# EAGLE design NSE2020_1 (EAGLE 9.6.1)
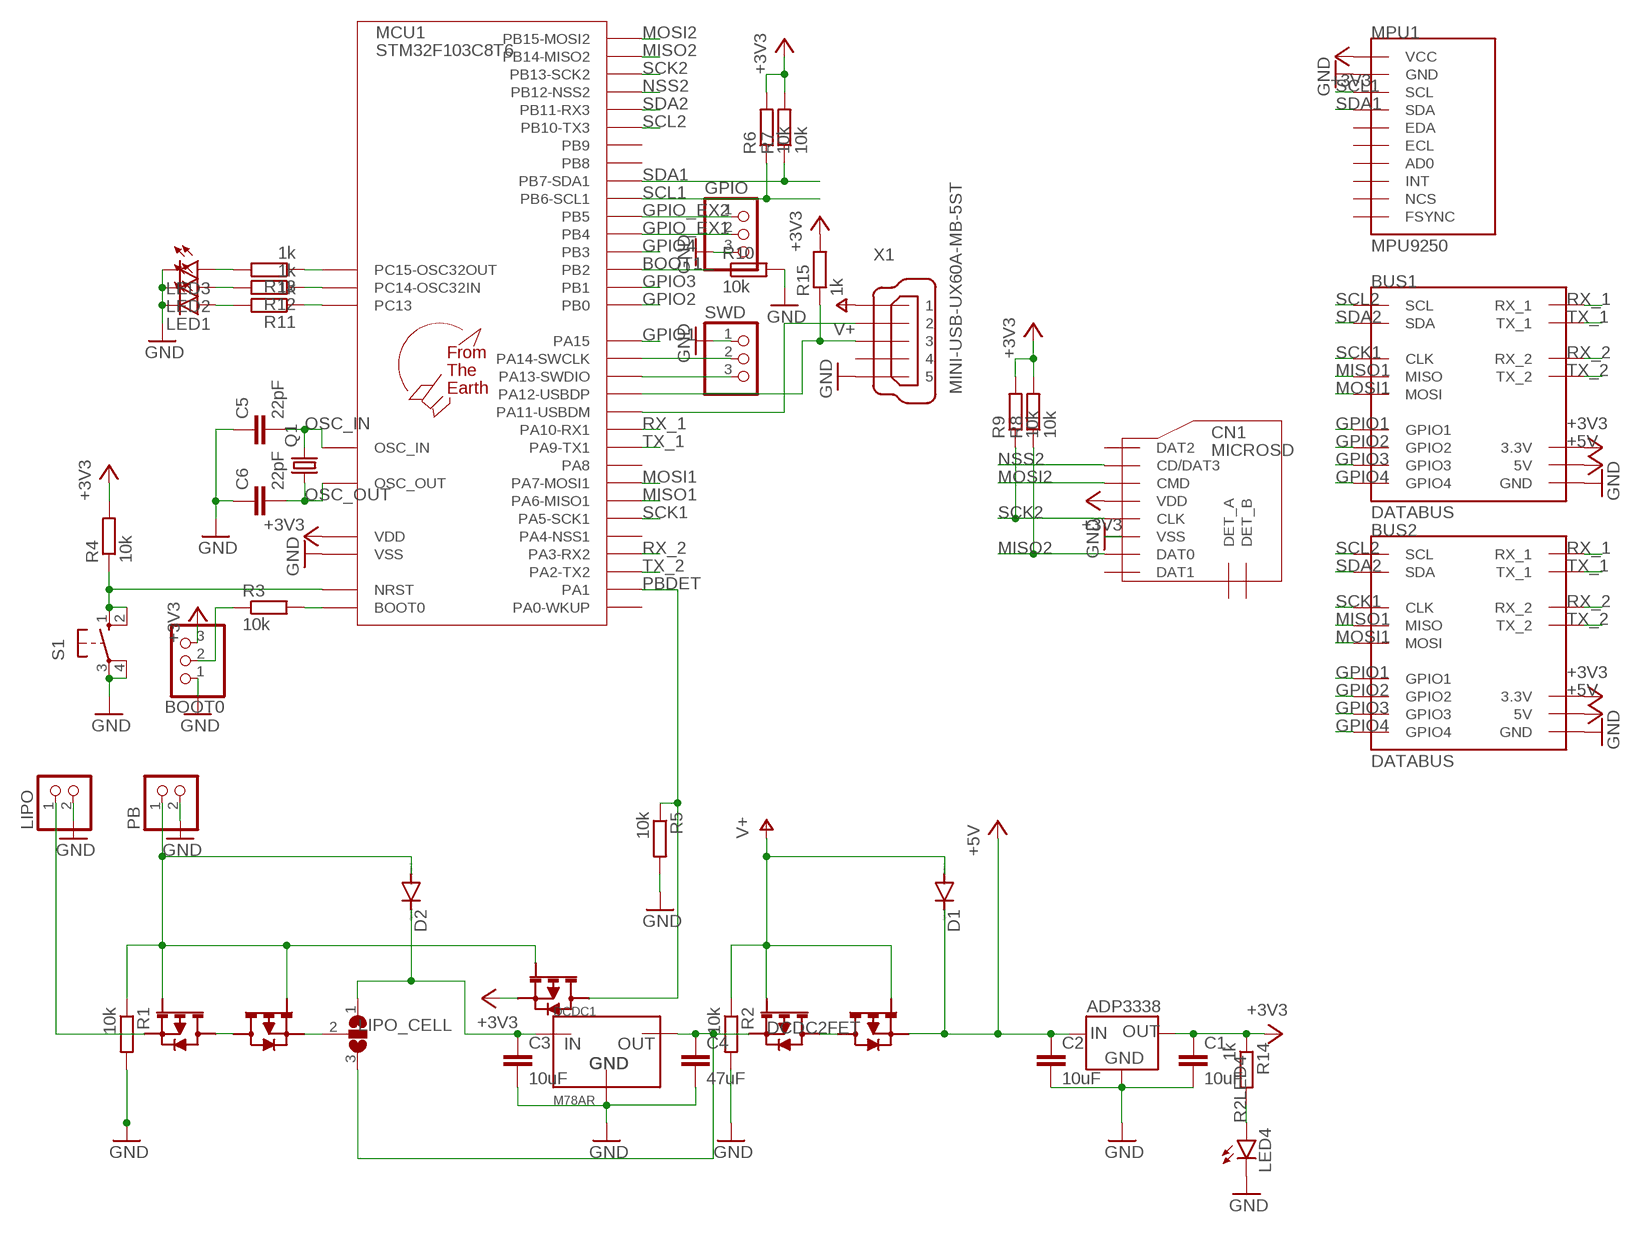
[diagram p0: schematic, sheet 1]

## Parts
BOOT0  PINHD-1X3  [1X03]
BUS1  DATABUS  [8X2]
BUS2  DATABUS  [8X2]
C1  10uF  C-EUC2012  [C2012]
C2  10uF  C-EUC2012  [C2012]
C3  10uF  C-EUC2012  [C2012]
C4  47uF  C-EUC2012  [C2012]
C5  22pF  C-EUC2012  [C2012]
C6  22pF  C-EUC2012  [C2012]
CN1  MICROSD  [DM3AT]
D1  DIODE-SOD123  [SOD123]
D2  DIODE-SOD123  [SOD123]
DCDC1  M78AR  [M78AR]
FET1  2SJ681  [2SJ681]
FET2  2SJ681  [2SJ681]
FET3  2SJ681  [2SJ681]
FET4  2SJ681  [2SJ681]
FET5  2SJ681  [2SJ681]
GPIO  PINHD-1X3  [1X03]
IC1  ADP3338-3.3  [SOT-223]
LED1  LEDSML0805  [SML0805]
LED2  LEDSML0805  [SML0805]
LED3  LEDSML0805  [SML0805]
LED4  LEDSML0805  [SML0805]
LIPO  PINHD-1X2  [1X02]
LIPO_CELL  SJ2W  [SJ_2]
MCU1  STM32F103C8T6  [LQFP48]
MPU1  MPU9250  [GY-9250]
PB  PINHD-1X2  [1X02]
Q1  CRYSTALHC49S  [HC49/S]
R1  10k  R-EU_M2012  [M2012]
R2  10k  R-EU_M2012  [M2012]
R3  10k  R-EU_M2012  [M2012]
R4  10k  R-EU_M2012  [M2012]
R5  10k  R-EU_M2012  [M2012]
R6  10k  R-EU_M2012  [M2012]
R7  10k  R-EU_M2012  [M2012]
R8  10k  R-EU_M2012  [M2012]
R9  10k  R-EU_M2012  [M2012]
R10  10k  R-EU_M2012  [M2012]
R11  1k  R-EU_M2012  [M2012]
R12  1k  R-EU_M2012  [M2012]
R13  1k  R-EU_M2012  [M2012]
R14  1k  R-EU_M2012  [M2012]
R15  1k  R-EU_M2012  [M2012]
S1  10-XX  [B3F-10XX]
SWD  PINHD-1X3  [1X03]
U$1  F.T.E.LOGO  [LOGO]
X1  MINI-USB-UX60A-MB-5ST  [UX60A-MB-5ST]

## Nets
+3V3 [PWR_L]: BOOT0.3 BUS1.P6(3.3V) BUS2.P6(3.3V) C1.1 CN1.VDD FET5.P$3 IC1.1(OUT) IC1.2(OUT) MCU1.1(VDD) MCU1.9(VDD) MCU1.24(VDD) MCU1.36(VDD) MCU1.48(VDD) MPU1.P1(VCC) R4.2 R6.2 R7.2 R8.2 R9.2 R14.1 R15.2
+5V [PWR_H]: BUS1.P7(5V) BUS2.P7(5V) C2.1 D1.C FET4.P$3 IC1.3(IN)
BAT2DCDC [PWR_H]: C3.1 D2.C DCDC1.P1(IN) LIPO_CELL.1
BOOT0 [SIGNAL]: BOOT0.2 R3.1
BOOT0_R [SIGNAL]: MCU1.44(BOOT0) R3.2
BOOT1 [SIGNAL]: MCU1.20(PB2) R10.1
DCDC2FET [PWR_H]: C4.1 DCDC1.P3(OUT) FET3.P$3 LIPO_CELL.3
DM [SIGNAL]: MCU1.32(PA11-USBDM) X1.2
DP [SIGNAL]: MCU1.33(PA12-USBDP) R15.1 X1.3
FET2FET [PWR_H]: FET3.P$2 FET3.P$4 FET4.P$2 FET4.P$4
FET2JUMP [PWR_H]: FET2.P$3 LIPO_CELL.2
GND [GND]: BOOT0.1 BUS1.P11(GND) BUS2.P11(GND) C1.2 C2.2 C3.2 C4.2 C5.1 C6.1 CN1.VSS DCDC1.P2(GND) GPIO.3 IC1.4(GND) LED1.C LED2.C LED3.C LED4.C LIPO.2 MCU1.8(VSS) MCU1.23(VSS) MCU1.35(VSS) MCU1.47(VSS) MPU1.P2(GND) PB.2 R1.2 R2.2 R5.2 R10.2 S1.3(P) S1.4(P1) SWD.1 X1.5
GPIO1 [SIGNAL]: BUS1.P3(GPIO1) BUS2.P3(GPIO1) MCU1.38(PA15)
GPIO2 [SIGNAL]: BUS1.P10(GPIO2) BUS2.P10(GPIO2) MCU1.18(PB0)
GPIO3 [SIGNAL]: BUS1.P14(GPIO3) BUS2.P14(GPIO3) MCU1.19(PB1)
GPIO4 [SIGNAL]: BUS1.P15(GPIO4) BUS2.P15(GPIO4) MCU1.39(PB3)
GPIO_EX1 [IO]: GPIO.2 MCU1.40(PB4)
GPIO_EX2 [IO]: GPIO.1 MCU1.41(PB5)
IO2R1 [IO]: MCU1.2(PC13) R11.1
IO2R2 [IO]: MCU1.3(PC14-OSC32IN) R12.1
IO2R3 [IO]: MCU1.4(PC15-OSC32OUT) R13.1
LIPO_FET2FET [PWR_H]: FET1.P$2 FET1.P$4 FET2.P$2 FET2.P$4
LIPOIN [PWR_H]: FET1.P$3 LIPO.1
MISO1 [SIGNAL]: BUS1.P12(MISO) BUS2.P12(MISO) MCU1.16(PA6-MISO1)
MISO2 [SIGNAL]: CN1.DAT0 MCU1.27(PB14-MISO2) R8.1
MOSI1 [SIGNAL]: BUS1.P2(MOSI) BUS2.P2(MOSI) MCU1.17(PA7-MOSI1)
MOSI2 [SIGNAL]: CN1.CMD MCU1.28(PB15-MOSI2)
NRST [SIGNAL]: MCU1.7(NRST) R4.1 S1.1(S) S1.2(S1)
NSS2 [SIGNAL]: CN1.CD/DAT3 MCU1.25(PB12-NSS2)
OSC_IN [IO]: C5.2 MCU1.5(OSC_IN) Q1.2
OSC_OUT [IO]: C6.2 MCU1.6(OSC_OUT) Q1.1
PBDET [SIGNAL]: FET5.P$2 FET5.P$4 MCU1.11(PA1) R5.1
PBIN [PWR_H]: D2.A FET1.P$1 FET2.P$1 FET5.P$1 PB.1 R1.1
R2LED1 [IO]: LED1.A R11.2
R2LED2 [IO]: LED2.A R12.2
R2LED3 [IO]: LED3.A R13.2
R2LED4 [IO]: LED4.A R14.2
RX_1 [SIGNAL]: BUS1.P4(RX_1) BUS2.P4(RX_1) MCU1.31(PA10-RX1)
RX_2 [SIGNAL]: BUS1.P9(RX_2) BUS2.P9(RX_2) MCU1.13(PA3-RX2)
SCK1 [SIGNAL]: BUS1.P1(CLK) BUS2.P1(CLK) MCU1.15(PA5-SCK1)
SCK2 [SIGNAL]: CN1.CLK MCU1.26(PB13-SCK2) R9.1
SCL1 [SIGNAL]: MCU1.42(PB6-SCL1) MPU1.P3(SCL) R6.1
SCL2 [SIGNAL]: BUS1.P0(SCL) BUS2.P0(SCL) MCU1.21(PB10-TX3)
SDA1 [SIGNAL]: MCU1.43(PB7-SDA1) MPU1.P4(SDA) R7.1
SDA2 [SIGNAL]: BUS1.P13(SDA) BUS2.P13(SDA) MCU1.22(PB11-RX3)
SWCLK [SIGNAL]: MCU1.37(PA14-SWCLK) SWD.2
SWDIO [SIGNAL]: MCU1.34(PA13-SWDIO) SWD.3
TX_1 [SIGNAL]: BUS1.P5(TX_1) BUS2.P5(TX_1) MCU1.30(PA9-TX1)
TX_2 [SIGNAL]: BUS1.P8(TX_2) BUS2.P8(TX_2) MCU1.12(PA2-TX2)
V+ [PWR_H]: D1.A FET3.P$1 FET4.P$1 R2.1 X1.1
Unconnected: CN1.DAT1 CN1.DAT2 CN1.DET_A CN1.DET_B MCU1.10(PA0-WKUP) MCU1.14(PA4-NSS1) MCU1.29(PA8) MCU1.45(PB8) MCU1.46(PB9) MPU1.P5(EDA) MPU1.P6(ECL) MPU1.P7(AD0) MPU1.P8(INT) MPU1.P9(NCS) MPU1.P10(FSYNC) X1.4

## Library data of the parts
BOOT0 GPIO SWD = pinhead:PINHD-1X3: PIN HEADER
BUS1 BUS2 = databus:DATABUS
C1-C6 = rcl:C-EU: CAPACITOR, European symbol; SPICEPREFIX: C
CN1 = microSD:MICROSD
D1 D2 = diode:DIODE-: DIODE
DCDC1 = M78AR:M78AR
FET1-FET5 = 2SJ681:2SJ681
IC1 = ADP3338:ADP3338-3.3
LED1-LED4 = led:LED: LED OSRAM: - CHIPLED LG R971, LG N971, LY N971, LG Q971, LY Q971, LO R971, LY R971 LH N974, LH R974 LS Q976, LO Q976, LY Q976 LO Q996 - Hyper CHIPLED LW Q18S LB Q993, LB Q99A, LB R99A - SideLED LS A670, LO A670, LY A670, LG A670, LP A670 LB A673, LV A673, LT A673, LW A673 LH A674 LY A675 LS A676, LA A676, LO A676, LY A676, LW A676 LS A679, LY A679, LG A679 - Hyper Micro SIDELED® LS Y876, LA Y876, LO Y876, LY Y876 LT Y87S - SmartLED LW L88C, LW L88S LB L89C, LB L89S, LG L890 LS L89K, LO L89K, LY L89K LS L896, LA L896, LO L896, LY L896 - TOPLED LS T670, LO T670, LY T670, LG T670, LP T670 LSG T670, LSP T670, LSY T670, LOP T670, LYG T670 LG T671, LOG T671, LSG T671 LB T673, LV T673, LT T673, LW T673 LH T674 LS T676, LA T676, LO T676, LY T676, LB T676, LH T676, LSB T676, LW T676 LB T67C, LV T67C, LT T67C, LS T67K, LO T67K, LY T67K, LW E67C LS E67B, LA E67B, LO E67B, LY E67B, LB E67C, LV E67C, LT E67C LW T67C LS T679, LY T679, LG T679 LS T770, LO T770, LY T770, LG T770, LP T770 LB T773, LV T773, LT T773, LW T773 LH T774 LS E675, LA E675, LY E675, LS T675 LS T776, LA T776, LO T776, LY T776, LB T776 LHGB T686 LT T68C, LB T68C - Hyper Mini TOPLED® LB M676 - Mini TOPLED Santana® LG M470 LS M47K, LO M47K, LY M47K Source: http://www.osram.convergy.de LUXEON: - LUMILED® LXK2-PW12-R00, LXK2-PW12-S00, LXK2-PW14-U00, LXK2-PW14-V00 LXK2-PM12-R00, LXK2-PM12-S00, LXK2-PM14-U00 LXK2-PE12-Q00, LXK2-PE12-R00, LXK2-PE12-S00, LXK2-PE14-T00, LXK2-PE14-U00 LXK2-PB12-K00, LXK2-PB12-L00, LXK2-PB12-M00, LXK2-PB14-N00, LXK2-PB14-P00, LXK2-PB14-Q00 LXK2-PR12-L00, LXK2-PR12-M00, LXK2-PR14-Q00, LXK2-PR14-R00 LXK2-PD12-Q00, LXK2-PD12-R00, LXK2-PD12-S00 LXK2-PH12-R00, LXK2-PH12-S00 LXK2-PL12-P00, LXK2-PL12-Q00, LXK2-PL12-R00 Source: www.luxeon.com KINGBRIGHT: KA-3528ASYC Source: www.kingbright.com
LIPO PB = pinhead:PINHD-1X2: PIN HEADER
LIPO_CELL = jumper:SJ2W: SMD solder JUMPER
MCU1 = STM32F103C8T6:STM32F103C8T6
MPU1 = MPU9250:MPU9250
Q1 = crystal:CRYSTAL: CRYSTAL; OC_FARNELL: 1667008; OC_NEWARK: unknown
R1-R15 = rcl:R-EU_: RESISTOR, European symbol; SPICEPREFIX: R
S1 = switch-omron:10-XX: OMRON SWITCH; MPN: B3F-1000; OC_FARNELL: 176432; OC_NEWARK: 36M3542
U$1 = logo:F.T.E.LOGO
X1 = con-hirose:MINI-USB-: MINI USB Connector Source: http://www.hirose.co.jp/cataloge_hp/e24000019.pdf; OC_FARNELL: unknown; OC_NEWARK: unknown

## Net classes
1 SIGNAL: width 0.229 mm, drill 0.305 mm, clearance 0.152 mm
2 PWR_H: width 0.635 mm, drill 0.305 mm, clearance 0.152 mm
3 PWR_L: width 0.305 mm, drill 0.305 mm, clearance 0.152 mm
4 GND: width 0.381 mm, drill 0.305 mm, clearance 0.152 mm
5 IO: width 0.305 mm, drill 0.305 mm, clearance 0.152 mm

## Board
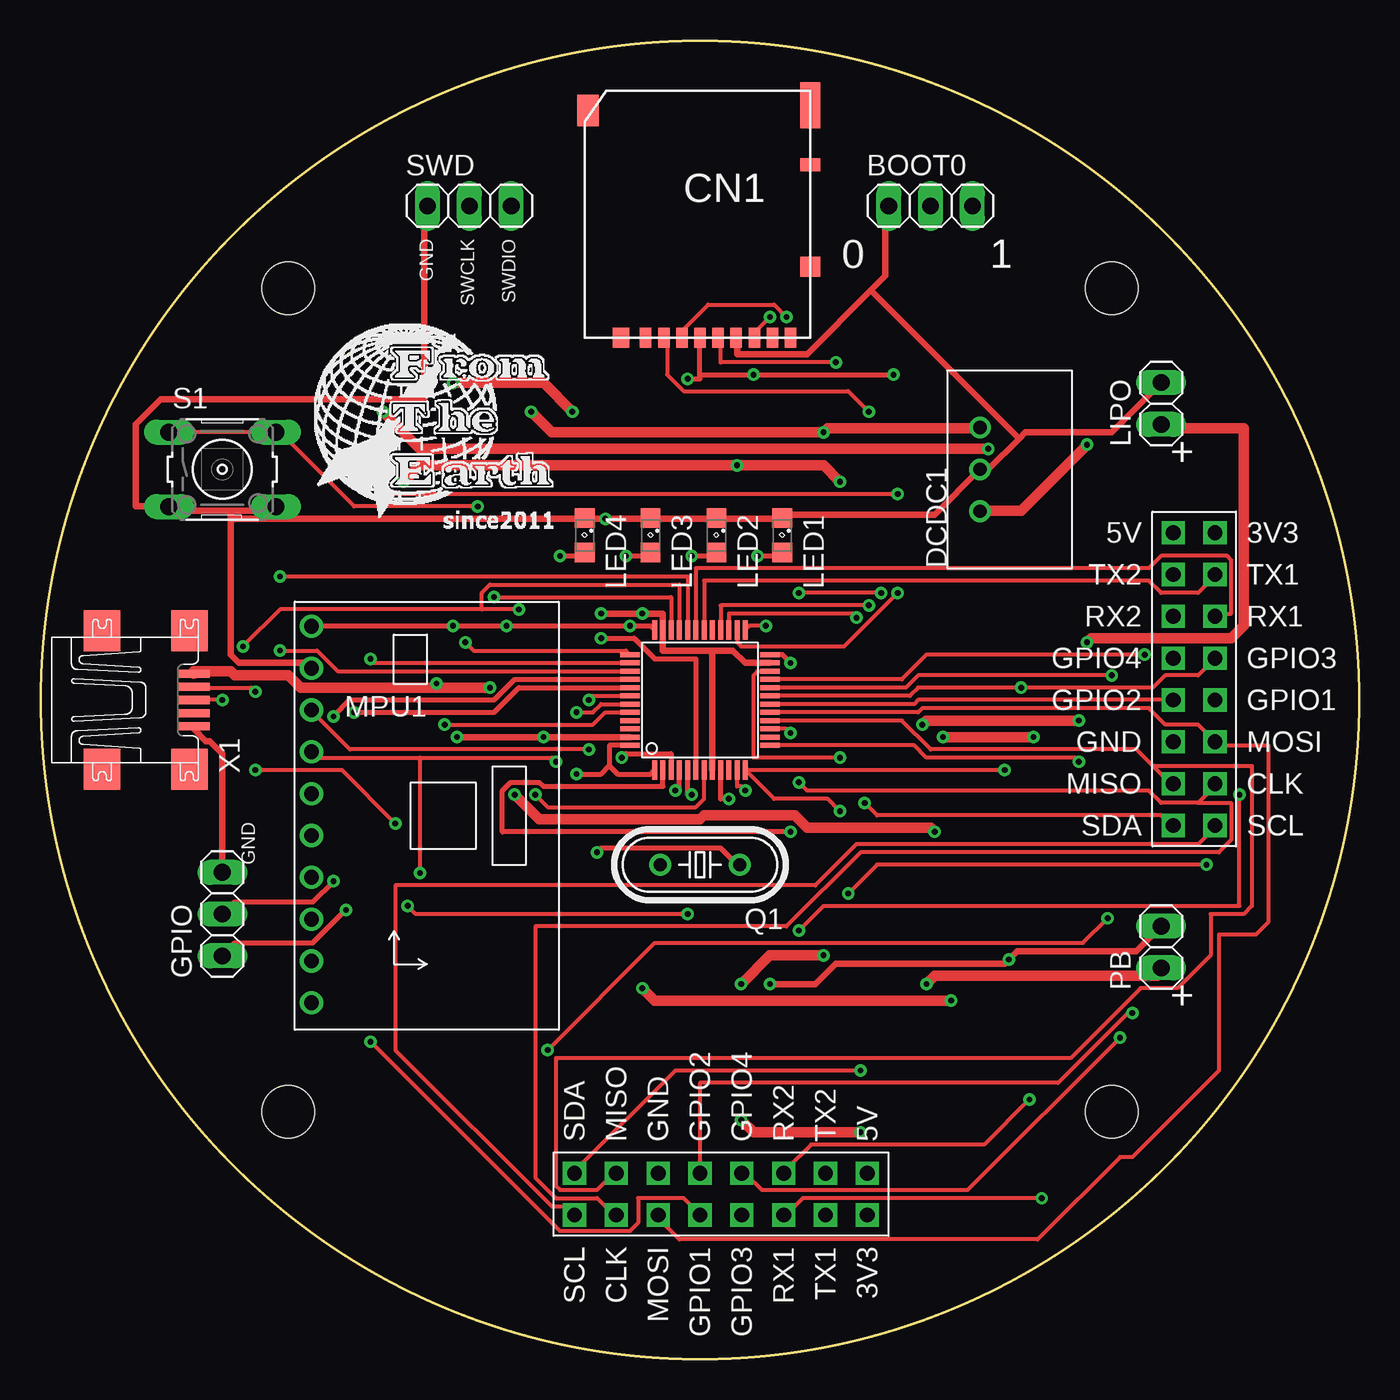
[diagram p1: board, top side]
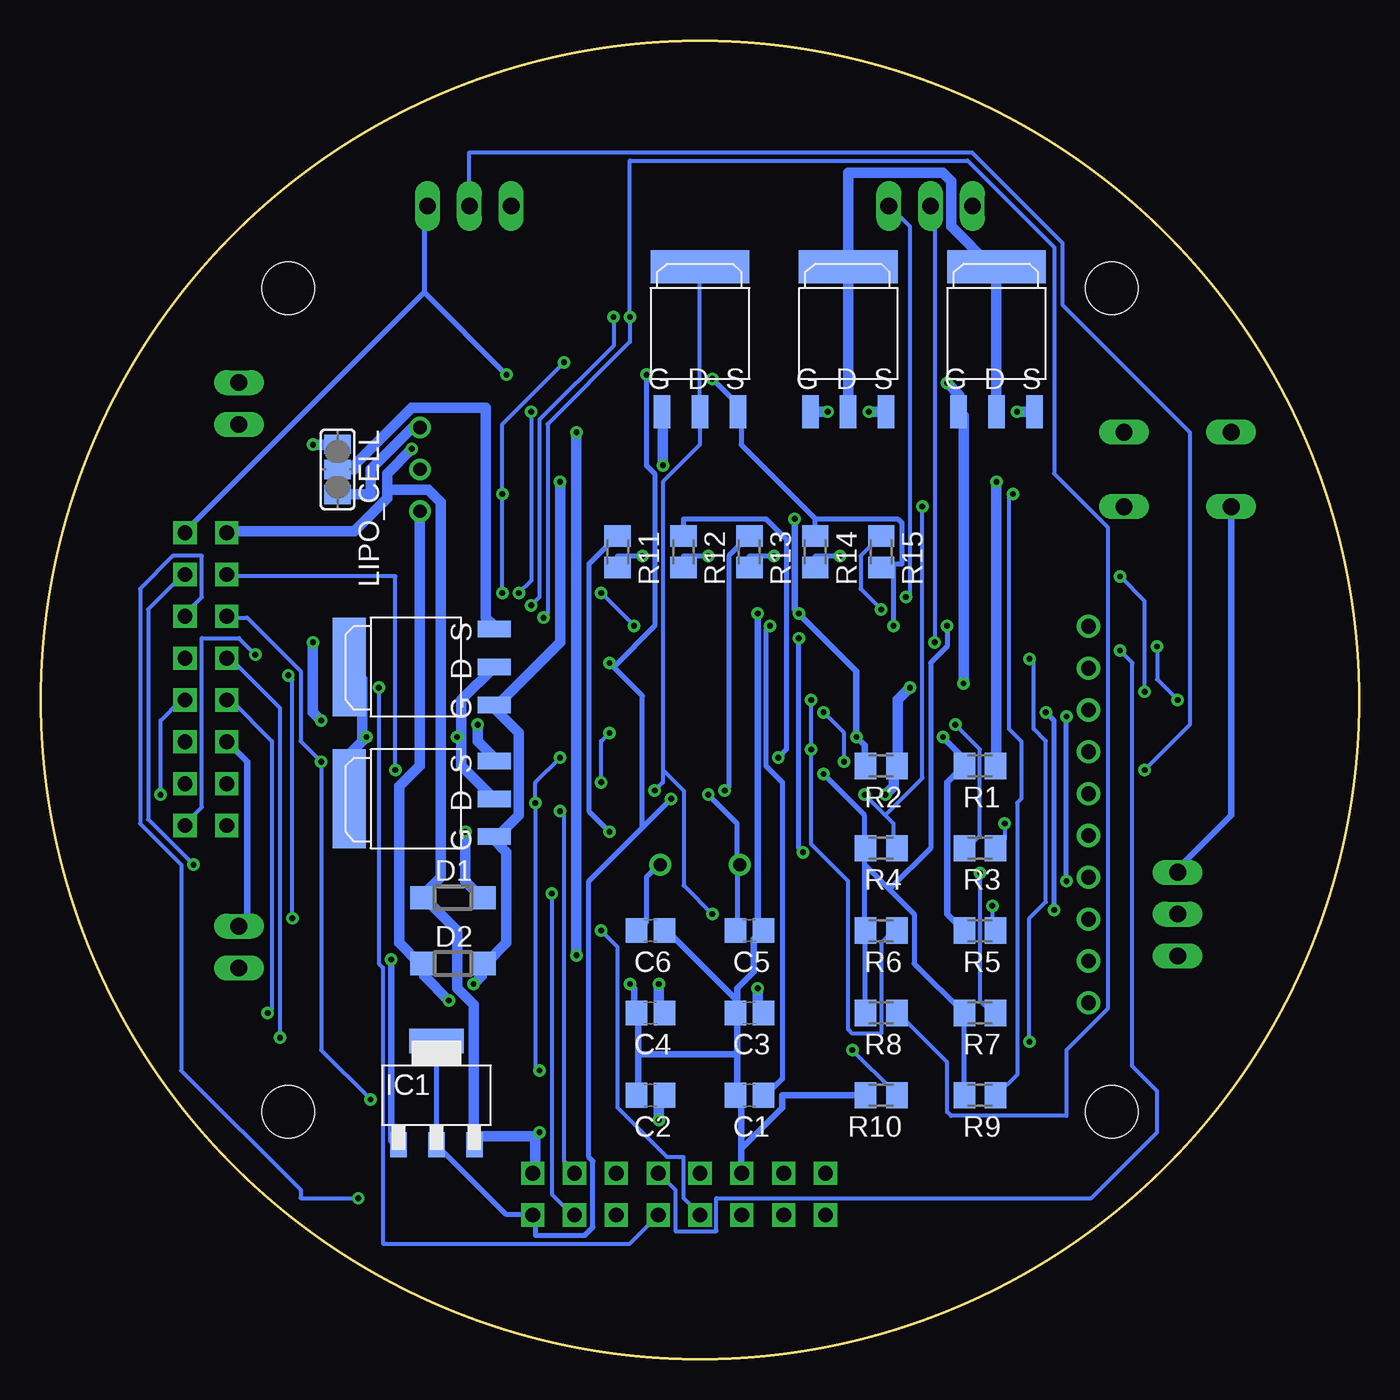
[diagram p2: board, bottom side, seen from below]

Size 80 x 80 mm. Coordinates in mm from the lower left corner, seen from the top.
Outline: circle at 40,40 radius 40
Copper layers (1*16): Top 0.035mm / dielectric 1.5mm / Bottom 0.035mm
Design rules "default": minimum track width 6mil, minimum drill 0.35mm, track to track 6mil, track to pad 6mil, pad to pad 6mil, via to via 6mil, smd to smd 6mil, copper to edge 40mil, drill to drill 6mil, minimum pad ring 10mil, minimum via ring 8mil, stop-mask expansion 4mil, vias tented up to drill 0mil, thermal gap 10mil
Holes 3.2 mm at 15,15 65,15 65,65 15,65
vRestrict: area 36,36 to 44,44

### Footprints (pad centres in the part's own frame; a part is rotated, then mirrored left to right if it is on the bottom)
1X03 = drill 1.016 long: 1 -2.54,0; 2 0,0; 3 2.54,0
8X2 = drill 0.9 square: P0 -1.27,7.62; P1 -1.27,5.08; P2 -1.27,2.54; P3 -1.27,0; P4 -1.27,-5.08; P5 -1.27,-7.62; P6 -1.27,-10.16; P7 1.27,-10.16; P8 1.27,-7.62; P9 1.27,-5.08; P10 1.27,0; P11 1.27,2.54; P12 1.27,5.08; P13 1.27,7.62; P14 -1.27,-2.54; P15 1.27,-2.54
C2012 = smd 1.3 x 1.5: 1 -0.85,0; 2 0.85,0
DM3AT = smd 0.7 x 1.2: CD/DAT3 2.2,6; CLK -1.1,6; CMD 1.1,6; DAT0 -3.3,6; DAT1 -4.4,6; DAT2 3.3,6; DET_B -5.5,6; VDD 0,6; VSS -2.2,6 | smd 1.2 x 0.8: DET_A -6.7,-4.5 | smd 1 x 1.2: P$9 4.8,6 | smd 1.2 x 1.2: P$11 -6.7,1.7 | smd 1.2 x 2.8: P$13 -6.7,-8.1 | smd 1.3 x 1.9: P$14 6.8,-7.8
SOD123 = smd 1.4 x 1.4: A 1.9,0; C -1.9,0
M78AR = drill 0.8: P1 -2.54,0; P2 0,0; P3 2.54,0
2SJ681 = smd 1 x 2: P$1 -2.3,-2.5; P$2 0,-2.5; P$3 2.3,-2.5 | smd 6 x 2: P$4 0,6.3
SOT-223 = smd 3.3 x 1.5: 1 0,3.3 | smd 1 x 1.5: 2 0,-3; 3 2.3,-3; 4 -2.3,-3
SML0805 = smd 1.2 x 1.2: A 1.05,0; C -1.05,0
1X02 = drill 1.016 long: 1 -1.27,0; 2 1.27,0
SJ_2 = smd 1.168 x 1.6: 1 -1.524,0; 2 0,0; 3 1.524,0
LQFP48 = smd 0.3 x 1.2: 1 -2.75,-4.25; 2 -2.25,-4.25; 3 -1.75,-4.25; 4 -1.25,-4.25; 5 -0.75,-4.25; 6 -0.25,-4.25; 7 0.25,-4.25; 8 0.75,-4.25; 9 1.25,-4.25; 10 1.75,-4.25; 11 2.25,-4.25; 12 2.75,-4.25; 25 2.75,4.25; 26 2.25,4.25; 27 1.75,4.25; 28 1.25,4.25; 29 0.75,4.25; 30 0.25,4.25; 31 -0.25,4.25; 32 -0.75,4.25; 33 -1.25,4.25; 34 -1.75,4.25; 35 -2.25,4.25; 36 -2.75,4.25 | smd 1.2 x 0.3: 13 4.25,-2.75; 14 4.25,-2.25; 15 4.25,-1.75; 16 4.25,-1.25; 17 4.25,-0.75; 18 4.25,-0.25; 19 4.25,0.25; 20 4.25,0.75; 21 4.25,1.25; 22 4.25,1.75; 23 4.25,2.25; 24 4.25,2.75; 37 -4.25,2.75; 38 -4.25,2.25; 39 -4.25,1.75; 40 -4.25,1.25; 41 -4.25,0.75; 42 -4.25,0.25; 43 -4.25,-0.25; 44 -4.25,-0.75; 45 -4.25,-1.25; 46 -4.25,-1.75; 47 -4.25,-2.25; 48 -4.25,-2.75
GY-9250 = drill 0.9: P1 -7,11.5; P2 -7,8.96; P3 -7,6.42; P4 -7,3.88; P5 -7,1.34; P6 -7,-1.2; P7 -7,-3.74; P8 -7,-6.28; P9 -7,-8.82; P10 -7,-11.36
HC49/S = drill 0.813: 1 -2.413,0; 2 2.413,0
M2012 = smd 1.3 x 1.6: 1 -0.95,0; 2 0.95,0
B3F-10XX = drill 1.016 long: 1 -3.251,2.261; 2 3.251,2.261; 3 -3.251,-2.261; 4 3.251,-2.261
UX60A-MB-5ST = smd 2 x 0.5: 1 2.25,1.6; 2 2.25,0.8; 3 2.25,0; 4 2.25,-0.8; 5 2.25,-1.6 | smd 2.2 x 2.5: M1 -3.3,-4.2; M2 -3.3,4.2; M3 2,4.2; M4 2,-4.2

### Placement (x,y rotation side)
BOOT0  54,70 0 top
BUS1  70,40 180 top
BUS2  40,10 90 top
C1  37,16 180 bottom
C2  43,16 180 bottom
C3  37,21 180 bottom
C4  43,21 180 bottom
C5  37,26 180 bottom
C6  43,26 180 bottom
CN1  40,68 180 top
D1  55,28 0 bottom
D2  55,24 0 bottom
DCDC1  57,54 90 top
FET1  55,34 90 bottom
FET2  55,42 90 bottom
FET3  31,60 0 bottom
FET4  22,60 0 bottom
FET5  40,60 0 bottom
GPIO  11,27 90 top
IC1  56,16 0 bottom
LED1  45,50 270 top
LED2  41,50 270 top
LED3  37,50 270 top
LED4  33,50 270 top
LIPO  68,58 90 top
LIPO_CELL  62,54 270 bottom
MCU1  40,40 0 top
MPU1  23.41,32.97 0 top
PB  68,25 90 top
Q1  40,30 180 top
R1  23,36 180 bottom
R2  29,36 180 bottom
R3  23,31 180 bottom
R4  29,31 180 bottom
R5  23,26 180 bottom
R6  29,26 180 bottom
R7  23,21 180 bottom
R8  29,21 180 bottom
R9  23,16 180 bottom
R10  29,16 180 bottom
R11  45,49 270 bottom
R12  41,49 270 bottom
R13  37,49 270 bottom
R14  33,49 270 bottom
R15  29,49 270 bottom
S1  11,54 0 top
SWD  26,70 0 top
U$1  16,49 0 top
X1  7,40 0 top

### Tracks (layer width: path | path; a pad name or v marks a point on that pad's centre or on a via)
+3V3  (via drill 0.35)
  Top 0.305: MCU1.9 41.25,34 v41.75,34 | MCU1.24 45,42.75 v45.5,42.25 | MCU1.1 37,35.5 35,35.5 34.5,36 | 34.5,36 34.5,37.25 MCU1.48 | 34.5,36 34,35.5 v32.5,35.5 | 40,59.75 40,59.5 v39.25,59.5 | 40,59.75 CN1.VDD | MCU1.36 37,44.5 v35.75,44.5 v28.25,44.5 v25,44.5 16.5,44.5 MPU1.P1 | 40,59.75 v43.25,59.75 v51.75,59.75
  Bottom 0.305: IC1.1 IC1.2 51.75,8.75 50.25,8.75 BUS2.P6 50,8.5 50,7.5 47,7.5 46.5,8 46.5,12 46.75,12.25 46.75,29 43.5,32.25 | 43.5,32.25 v41.75,34 | 45.25,42 43.5,40.25 43.5,32.25 | 56.75,64.75 71.25,50.25 BUS1.P6 | 56.75,64.75 56.75,70 BOOT0.3 | 24,21 24,16 R9.2 | 30,26 30,21 R8.2 | 30,26 30,30 | 30,30 30,31 | 30,26 R6.2 | v32.5,35.5 30,33 30,31 | 30,31 R4.2 | 24,21 27,24 27,27 28.5,28.5 | 30,30 28.5,28.5 | 24,21 R7.2 | 28.25,48.25 27.75,48.25 27.75,50.75 28,51 33,51 | 28.25,48.25 29,48.25 R15.2 28.25,48.25 | R14.1 33,51 | v39.25,59.5 37.75,58 37.75,57.5 FET5.P$3 37.5,57.5 37.5,55.5 33,51 | v35.75,44.5 36,44.25 36,36 35,35 35,17 36,16 C1.1 | v28.25,44.5 28.25,48.25 | 28.5,28.5 26,31 26,42.25 25,43.25 v25,44.5 | v51.75,59.75 56.75,64.75 | 45.25,42 42.75,44.5 42.75,53.75 43.25,54.25 v43.25,59.75 | 45.25,42 v45.5,42.25
+5V  (via drill 0.35)
  Top 0.635: v42.5,14.5 43.25,13.75 v49.75,13.75 | v20.75,57.5 23,55.25 v57.5,55.25
  Bottom 0.635: v42.5,14.5 42.5,15.75 42.25,16 C2.1 | 50,13.5 v49.75,13.75 | 50,13.5 50,11.5 BUS2.P7 | 50,13.5 53.5,13.5 IC1.3 53.75,13 53.75,21.5 54.75,22.5 54.75,26 56.75,28 D1.C 56.75,28.25 55.75,29.25 55.75,52 56.5,52.75 59,52.75 | v20.75,57.5 FET4.P$3 | v57.5,55.25 59,53.75 59,52.75 | 59,52.75 59,52.25 61,50.25 68.5,50.25 BUS1.P7
BAT2DCDC  (via drill 0.35)
  Top 0.635: v36.5,22.5 37.25,21.75 v55.25,21.75 | v63.5,55.5 59.5,51.5 57,51.5 DCDC1.P1
  Bottom 0.635: DCDC1.P1 57,36 58.25,34.75 58.25,25.25 57,24 D2.C 56.75,23.75 56.75,23.25 v55.25,21.75 | v36.5,22.5 36.5,21.25 36.25,21 C3.1 | v63.5,55.5 62,55.5 LIPO_CELL.1
BOOT0  (via drill 0.35)
  Top 0.229: v21.5,32.5 18.25,35.75 v13,35.75
  Bottom 0.229: v21.5,32.5 21.5,31.5 22,31 R3.1 | v13,35.75 10.25,38.5 10.25,56.25 18,64 18,67.75 23.5,73.25 54,73.25 BOOT0.2
BOOT0_R  (via drill 0.35)
  Top 0.229: MCU1.44 34.25,39.25 33.5,38.5 v24.5,38.5
  Bottom 0.229: v24.5,38.5 23,37 23,31.75 23.75,31 R3.2
BOOT1  (via drill 0.35)
  Top 0.229: MCU1.20 52.5,40.75 53.25,41.5 v65,41.5 | v64.75,26.75 63.25,25.25 37.25,25.25 v30.75,18.75
  Bottom 0.229: v65,41.5 64.75,41.25 v64.75,26.75 | v30.75,18.75 28.25,16.25 28.25,16 R10.1
DCDC2FET  (via drill 0.35)
  Top 0.635: v42.5,22.75 44.25,24.5 v47.5,24.5 | DCDC1.P3 57,56.5 47.75,56.5 v47.5,56.25 31,56.25 v29.75,57.5
  Bottom 0.635: v42.5,22.75 42.5,21.25 42.25,21 C4.1 | v47.5,56.25 v47.5,24.5 | LIPO_CELL.3 62,52.5 60,52.5 60,54 57.5,56.5 57,56.5 DCDC1.P3 | v29.75,57.5 FET3.P$3
DM  (via drill 0.35)
  Top 0.229: MCU1.32 39.25,47.5 v14.5,47.5 | v13,40.5 12.75,40.75 9.25,40.75 X1.2
  Bottom 0.229: v14.5,47.5 13,46 v13,40.5
DP  (via drill 0.35)
  Top 0.229: MCU1.33 38.75,47 27.25,47 26.75,46.5 26.75,45.5 | v29,45.5 26.75,45.5 | v11,40 X1.3 | v12.25,43.25 14.5,45.5 26.75,45.5
  Bottom 0.229: v29,45.5 30.25,46.75 30.25,48.75 29,50 R15.1 | v11,40 12.25,41.25 v12.25,43.25
FET2FET
  Bottom 0.635: FET4.P$2 FET4.P$4 22.25,66.25 24.75,68.75 24.75,71.5 25.25,72 31,72 FET3.P$4 FET3.P$2
FET2JUMP
  Bottom 0.635: LIPO_CELL.2 61,54 61,54.25 57.5,57.75 53,57.75 53,45 52.5,44.5 FET2.P$3
GND  (via drill 0.35)
  Top 0.381: PB.2 68,26.25 66.5,24.75 59.25,24.75 v58.75,24.25 58.5,24 48.25,24 47,22.75 v44.25,22.75 | 40.75,43 42,43 42.75,42.25 MCU1.23 | 40.75,43 37.75,43 MCU1.35 37.75,45.25 v36.5,45.25 v34,45.25 | 40.75,43 MCU1.8 | MCU1.47 v30.5,37.75 v25.25,37.75 | 50.38,64.88 51.25,65.75 51.25,70 BOOT0.1 | 50.38,64.88 46.5,61 42.25,61 42.25,62 CN1.VSS | 37,51 v34.25,51 33,51 | 37,51 41,51 | 37,51 LED3.C | 41,51 45,51 LED1.C 45,51.25 54.25,51.25 DCDC1.P2 57.5,54 59.38,55.88 | 41,51 LED2.C | 59.38,55.88 59.75,56.25 65,56.25 68,59.25 LIPO.2 | 59.38,55.88 50.38,64.88 | GPIO.3 11,36.75 10.25,37.5 10,37.5 9.25,38.25 X1.5 | 11.5,51.5 11.5,51 | 11.5,51 11.5,42.75 12,42.25 16,42.25 16.25,42 MPU1.P2 | 11.5,51.5 14.25,51.5 S1.4 | 11.5,51.5 7.75,51.5 S1.3 7.5,51.75 5.75,51.75 5.75,56.75 7.25,58.25 23.25,58.25 23.25,70 SWD.1 | 11.5,51 33,51 | 33,51 LED4.C
  Bottom 0.381: v58.75,24.25 58.75,13.25 58.5,13 IC1.4 | BUS1.P11 68.5,37.25 67.5,36.25 67.5,27 68,26.5 PB.2 | 43.75,18.5 43.75,21 C4.2 44,21 44,22.5 v44.25,22.75 | 43.75,18.5 43.75,16 C2.2 | 37.75,16 37.5,15.75 37.5,12.75 | 37.5,12.75 37.5,11.5 BUS2.P11 | 37.75,16 37.75,18.5 | 37.75,18.5 37.75,21 | 37.75,16 C1.2 | 37.75,21 37.75,21.75 | 37.75,21.75 37.75,22.5 36.75,23.5 36.75,25.5 36.25,26 C5.1 36.5,26 v36.5,45.25 | 37.75,21 C3.2 | 37.75,21.75 42,26 C6.1 | R10.2 35,16 35,15.25 37.5,12.75 | 37.75,18.5 43.75,18.5 | R2.2 30,36 30,37.25 v30.5,37.75 30.5,41.75 v34,45.25 34.25,45.5 v34.25,51 | R5.2 24,26 25,27 25,35 24,36 R1.2 24.25,36 24.25,36.75 v25.25,37.75 | GPIO.3 11,29.75 7.75,33 7.75,51.5 S1.3
GPIO1  (via drill 0.35)
  Top 0.229: MCU1.38 20.25,42.25 v20,42.5 | v20,19.25 31.5,7.75 35.75,7.75 36.25,8.25 36.25,9.75 39,9.75 40,8.75 BUS2.P3 | v72.75,34.25 72.75,27.5 47.5,27.5 v46,26
  Bottom 0.229: v20,42.5 19.75,42.25 19.75,38.25 19,37.5 19,27.75 20,26.75 v20,19.25 | v72.75,34.25 72.75,38.75 71.5,40 BUS1.P3 | v46,26 45,25 45,15.25 42,12.25 41,12.25 41,9.75 40,8.75 BUS2.P3
GPIO2  (via drill 0.35)
  Top 0.229: MCU1.18 53,39.75 53.25,40 BUS1.P10 | BUS2.P10 40,16.75 61.75,16.75 66,21 v66.25,21
  Bottom 0.229: v66.25,21 66,21.25 66,37.5 68.5,40 BUS1.P10
GPIO3  (via drill 0.35)
  Top 0.229: MCU1.19 52.75,40.25 53.25,40.75 v59.5,40.75 67.5,40.75 68.25,41.5 70.25,41.5 71.25,42.5 BUS1.P14
  Bottom 0.229: v59.5,40.75 59.5,24 59.25,23.75 59.25,7 44.25,7 42.75,8.5 BUS2.P14
GPIO4  (via drill 0.35)
  Top 0.229: MCU1.39 18,41.75 16.75,43 v14.5,43 | v65.5,19.5 56.25,10.25 43.75,10.25 42.75,11.25 BUS2.P15
  Bottom 0.229: v14.5,43 13.75,42.25 13.75,17.75 12.25,16.25 12.25,13.75 16.25,9.75 39,9.75 39,7.75 41.5,7.75 41.5,10.25 42.5,11.25 BUS2.P15 | v65.5,19.5 65.5,39.5 68.5,42.5 BUS1.P15
GPIO_EX1  (via drill 0.35)
  Top 0.305: MCU1.40 28.75,41.25 27.5,40 18.75,40 v17.75,39 | v17.75,29 16.5,27.75 11.75,27.75 GPIO.2
  Bottom 0.305: v17.75,29 v17.75,39
GPIO_EX2  (via drill 0.35)
  Top 0.305: MCU1.41 29,40.75 27.5,39.25 v19,39.25 | v18.5,27.25 16.5,25.25 11.75,25.25 11,24.5 GPIO.1
  Bottom 0.305: v19,39.25 18.5,38.75 v18.5,27.25
IO2R1  (via drill 0.35)
  Top 0.305: MCU1.2 37.75,34.75 30.5,34.75 30.25,35 28.5,35 28,34.5 28,32 v45.5,32
  Bottom 0.305: v45.5,32 46.75,33.25 46.75,48.25 45,50 R11.1
IO2R2  (via drill 0.35)
  Top 0.305: MCU1.3 38.25,36.75 35.5,36.75 v35.25,36.5
  Bottom 0.305: v35.25,36.5 34.75,37 34.75,49.75 36,51 41,51 R12.1
IO2R3  (via drill 0.35)
  Top 0.305: MCU1.4 38.75,34.5 v38.5,34.5
  Bottom 0.305: v38.5,34.5 38.25,34.75 38.25,48.75 37,50 R13.1
LIPO_FET2FET  (via drill 0.35)
  Top 0.635: v60.25,37.75 v54.75,37.75
  Bottom 0.635: FET1.P$2 54.5,36 54.5,37.75 | 54.5,37.75 54.5,40 FET2.P$2 | v54.75,37.75 54.5,37.75 | FET1.P$4 61.25,34 61.25,36.75 v60.25,37.75 60.5,37.75 60.5,41.25 61.25,42 FET2.P$4
LIPOIN  (via drill 0.35)
  Top 0.635: v53.5,38.5 53.75,38.75 v63,38.75 | v63.5,43.5 63.75,43.75 72.25,43.75 73,44.5 73,56.5 68,56.5 LIPO.1
  Bottom 0.635: v53.5,38.5 53.5,37.5 52.5,36.5 FET1.P$3 | v63,38.75 63.5,39.25 v63.5,43.5
MISO1
  Top 0.229: MCU1.16 52.25,38.75 54,37 66.5,37 67.5,36 | 67.5,36 68.5,35 BUS1.P12 | 67.5,36 73.5,36 73.5,27.5 73,27 71,27 71,24.5 69,22.5 66.75,22.5 62.5,18.25 31.25,18.25 31.25,10.5 31.5,10.25 33.75,10.25 34.75,11.25 BUS2.P12
MISO2  (via drill 0.35)
  Top 0.229: MCU1.27 41.75,45.25 49.25,45.25 v49.5,45 | v44.25,63.25 43.5,62.5 43.5,62 CN1.DAT0
  Bottom 0.229: v49.5,45 49.25,45.25 49.25,56.75 44.25,61.75 v44.25,63.25 44.25,72.75 23.75,72.75 18.5,67.5 18.5,53.75 15.25,50.5 15.25,21.25 17.75,18.75 17.75,14.75 24.75,14.75 25,15 25,18 28,21 R8.1
MOSI1
  Top 0.229: MCU1.17 53.25,39.25 53.5,39.5 67.25,39.5 68.25,38.5 70.25,38.5 71.25,37.5 BUS1.P2 71.5,37.25 74.5,37.25 74.5,26.5 73.75,25.75 71.5,25.75 71.5,17.5 66.25,12.25 65.5,12.25 60.5,7.25 38.75,7.25 37.5,8.5 BUS2.P2
MOSI2  (via drill 0.35)
  Top 0.229: MCU1.28 41.25,45.75 v50.25,45.75 | v45.25,63.25 44.5,64 40.5,64 39,62.5 39,62 CN1.CMD
  Bottom 0.229: v50.25,45.75 49.75,46.25 49.75,57 45.25,61.5 v45.25,63.25
NRST  (via drill 0.35)
  Top 0.229: S1.1 S1.2 14.5,56.25 19,51.75 v26.5,51.75 | MCU1.7 40.25,34 39.75,33.5 30.75,33.5 v30,34.25
  Bottom 0.229: 28.75,33 28.25,32.5 28.25,31 R4.1 | 28.75,33 v30,34.25 | v26.5,51.75 26.5,35.25 28.75,33
NSS2  (via drill 0.35)
  Top 0.229: MCU1.25 43,44.5 v44,44.5 | v51,46.5 v46,46.5 | v50.25,57.5 49,58.75 39,58.75 38,59.75 38,62 CN1.CD/DAT3
  Bottom 0.229: v46,46.5 v44,44.5 | v51,46.5 50.25,47.25 v50.25,57.5
OSC_IN  (via drill 0.35)
  Top 0.305: MCU1.5 39.25,34.25 v39.5,34.25
  Bottom 0.305: v39.5,34.25 37.75,32.5 37.75,30 | 37.75,30 37.75,26 C5.2 | 37.75,30 Q1.2
OSC_OUT  (via drill 0.35)
  Top 0.305: MCU1.6 39.75,42.5 37.25,42.5 36,43.75 v34,43.75 | v33.75,30.75 34,31 41.25,31 42.25,30 Q1.1
  Bottom 0.305: v34,43.75 34,31 v33.75,30.75 | C6.2 43.75,26 43.25,26.5 43.25,29.25 42.5,30 Q1.1
PBDET  (via drill 0.35)
  Top 0.229: MCU1.11 42.25,34.75 42.5,34.75 v42.75,34.5 | v22.25,27.5 22.75,27 v39.25,27
  Bottom 0.229: v42.75,34.5 42.25,35 MCU1.11 | MCU1.11 42.25,53.25 40,55.5 FET5.P$2 FET5.P$4 | v22.25,27.5 22.25,26 R5.1 | v39.25,27 41,28.75 41,34.5 MCU1.11
PBIN  (via drill 0.35)
  Top 0.635: v53.75,22.75 54.25,23.25 67.75,23.25 68,23.5 PB.1 | v22,53.25 23,54.25 v42.25,54.25 47.5,54.25 v48.5,53.25
  Bottom 0.635: v53.75,22.75 53.25,23.25 53.25,23.75 D2.A 53,24 51.75,25.25 51.75,30.75 52.5,31.5 FET1.P$1 52.25,31.75 51,33 51,38 52.5,39.5 FET2.P$1 52.25,39.75 48.5,43.5 v48.5,53.25 | v22,53.25 22,36 R1.1 | v42.25,54.25 42.25,57.5 FET5.P$1
R2LED1  (via drill 0.35)
  Top 0.305: v43.5,48.75 45,48.75 LED1.A
  Bottom 0.305: v43.5,48.75 45,48.75 R11.2
R2LED2  (via drill 0.35)
  Top 0.305: v39.5,48.75 41,48.75 LED2.A
  Bottom 0.305: v39.5,48.75 41,48.75 R12.2
R2LED3  (via drill 0.35)
  Top 0.305: v35.5,48.75 37,48.75 LED3.A
  Bottom 0.305: v35.5,48.75 37,48.75 R13.2
R2LED4  (via drill 0.35)
  Top 0.305: v31.5,48.75 33,48.75 LED4.A
  Bottom 0.305: v31.5,48.75 33,48.75 R14.2
RX_1  (via drill 0.35)
  Top 0.229: MCU1.31 39.75,48 67.25,48 68,48.75 72,48.75 72.25,48.5 72.25,45.25 71.5,45.25 BUS1.P4 | v60.75,9.75 46.25,9.75 45.25,8.75 BUS2.P4
  Bottom 0.229: v60.75,9.75 64.25,9.75 64.25,10.25 71.5,17.5 71.5,30 74,32.5 74,46.75 72,48.75 70.25,48.75 70.25,46.25 71.25,45.25 BUS1.P4
RX_2  (via drill 0.35)
  Top 0.229: MCU1.13 53,37.25 53.75,36.5 62.75,36.5 v63,36.25 | v60,15.75 57.25,13 46.75,13 45.25,11.5 BUS2.P9
  Bottom 0.229: BUS1.P9 68.5,45 67.5,45 64.25,41.75 64.25,37.5 v63,36.25 63,18.75 v60,15.75
SCK1  (via drill 0.35)
  Top 0.229: MCU1.15 45.25,38.25 v45.5,38 | v46,35 46.5,34.5 67.25,34.5 68,33.75 70.25,33.75 | 70.25,33.75 71.25,34.75 BUS1.P1 | 70.25,33.75 72.25,33.75 72.25,31.5 71.5,30.75 49.75,30.75 45.25,26.25 30,26.25 30,11 31.25,9.75 33.75,9.75 34.75,8.75 BUS2.P1
  Bottom 0.229: v45.5,38 46,37.5 v46,35
SCK2  (via drill 0.35)
  Top 0.229: v48.25,60.5 41.25,60.5 41.25,62 CN1.CLK | v52,46.5 48.75,43.25 42.5,43.25 42.25,43.5 MCU1.26 | v52,52.5 v21,52.5
  Bottom 0.229: v48.25,60.5 52,56.75 v52,52.5 v52,46.5 | v21,52.5 21.25,52.25 21.25,38.25 20.5,37.5 20.5,34 20.75,33.75 20.75,17.25 22,16 R9.1
SCL1  (via drill 0.35)
  Top 0.229: MCU1.42 33.5,40.25 v33.25,40 | v33.25,37 18.75,37 16.5,39.25 MPU1.P3
  Bottom 0.229: v33.25,40 v33.25,37 33.25,31.25 31,29 31,20 30.75,19.75 29,19.75 29,25.25 28.25,26 R6.1
SCL2  (via drill 0.35)
  Top 0.229: MCU1.21 52.25,41.25 53.75,42.75 v67,42.75 | BUS2.P0 32.25,8.75 31.75,9.25 31,9.25 21.5,18.75 21.5,28.75 47,28.75 49.5,31.25 70.25,31.25 71.25,32.25 BUS1.P0
  Bottom 0.229: v67,42.75 68,43.75 70.25,43.75 70.25,33.5 71.25,32.5 BUS1.P0
SDA1  (via drill 0.35)
  Top 0.229: MCU1.43 34,39.75 33.5,39.25 v32.5,39.25 | v31.25,36.25 31,36.5 23,36.5 | 23,36.5 16.75,36.5 16.5,36.75 MPU1.P4 | 23,36.5 v23,29.5
  Bottom 0.229: v32.5,39.25 31.25,38 v31.25,36.25 | v23,29.5 23,21.75 22.25,21 R7.1
SDA2  (via drill 0.35)
  Top 0.229: MCU1.22 43.5,41.75 43.25,41.5 43.25,36.5 v48.5,36.5 | v50,33.75 50.75,33 68,33 68.5,32.5 BUS1.P13 | v49.75,17.5 38.5,17.5 32.5,11.5 BUS2.P13
  Bottom 0.229: v48.5,36.5 50,35 v50,33.75 50,17.75 v49.75,17.5
SWCLK  (via drill 0.35)
  Top 0.229: MCU1.37 35.5,43 26.25,43 v25.75,43.5
  Bottom 0.229: v25.75,43.5 25.75,69.75 SWD.2
SWDIO  (via drill 0.35)
  Top 0.229: MCU1.34 38.25,46.25 v27.5,46.25
  Bottom 0.229: v27.5,46.25 27.25,46.5 27.25,68.75 28.5,70 SWD.3
TX_1  (via drill 0.35)
  Top 0.229: MCU1.30 40.25,47.25 67.25,47.25 68,46.5 70.25,46.5 71.25,47.5 BUS1.P5 | v49,28.25 50.75,30 v70.75,30
  Bottom 0.229: v49,28.25 49,10 47.75,8.75 BUS2.P5 | v70.75,30 73.5,32.75 73.5,45.5 71.5,47.5 BUS1.P5
TX_2  (via drill 0.35)
  Top 0.229: v48.5,33.25 47.75,34 44.5,34 MCU1.12 v58.5,35.75
  Bottom 0.229: v48.5,33.25 48.25,33 48.25,12 47.75,11.5 BUS2.P8 | v58.5,35.75 58.5,47.5 68.5,47.5 BUS1.P8
V+  (via drill 0.35)
  Top 0.635: v54.25,32 54,32.25 46.5,32.25 45.75,33 40.25,33 40,32.75 30.25,32.75 v28.75,34.25 | v27.25,40.75 24,40.75 | 24,40.75 15.75,40.75 15,41.5 11.75,41.5 11.5,41.75 9.25,41.75 X1.1 | v24,41 24,40.75 | v32.25,57.5 30.5,59.25 v25,59.25
  Bottom 0.635: v54.25,32 54.25,29 53.25,28 D1.A | v28.75,34.25 28.25,34.75 28.25,36 R2.1 28,36.25 28,40 v27.25,40.75 | v24,41 24,57.25 24.25,57.5 FET4.P$1 24.25,57.75 24.25,58.5 v25,59.25 | v32.25,57.5 FET3.P$1

### Text on the board
tNames: GND | SWCLK | SWDIO | 0 | 1 | + | GND | +